# Altium schematic sheet [2] - Header and I2C.SchDoc: Header and I2C
size A4 portrait; ApprovedBy: Team 7; CheckedBy: Charitonidis A.; Author: Charitonidis Alexandros; DrawnBy: Charitonidis A.; Engineer: Charitonidis Alexandros; Organization: SMAQ; Address1: Glasgow; Address4: Australia 2086; DocumentNumber: SCH-001; Revision: 1.1; SheetNumber: 2; SheetTotal: 6
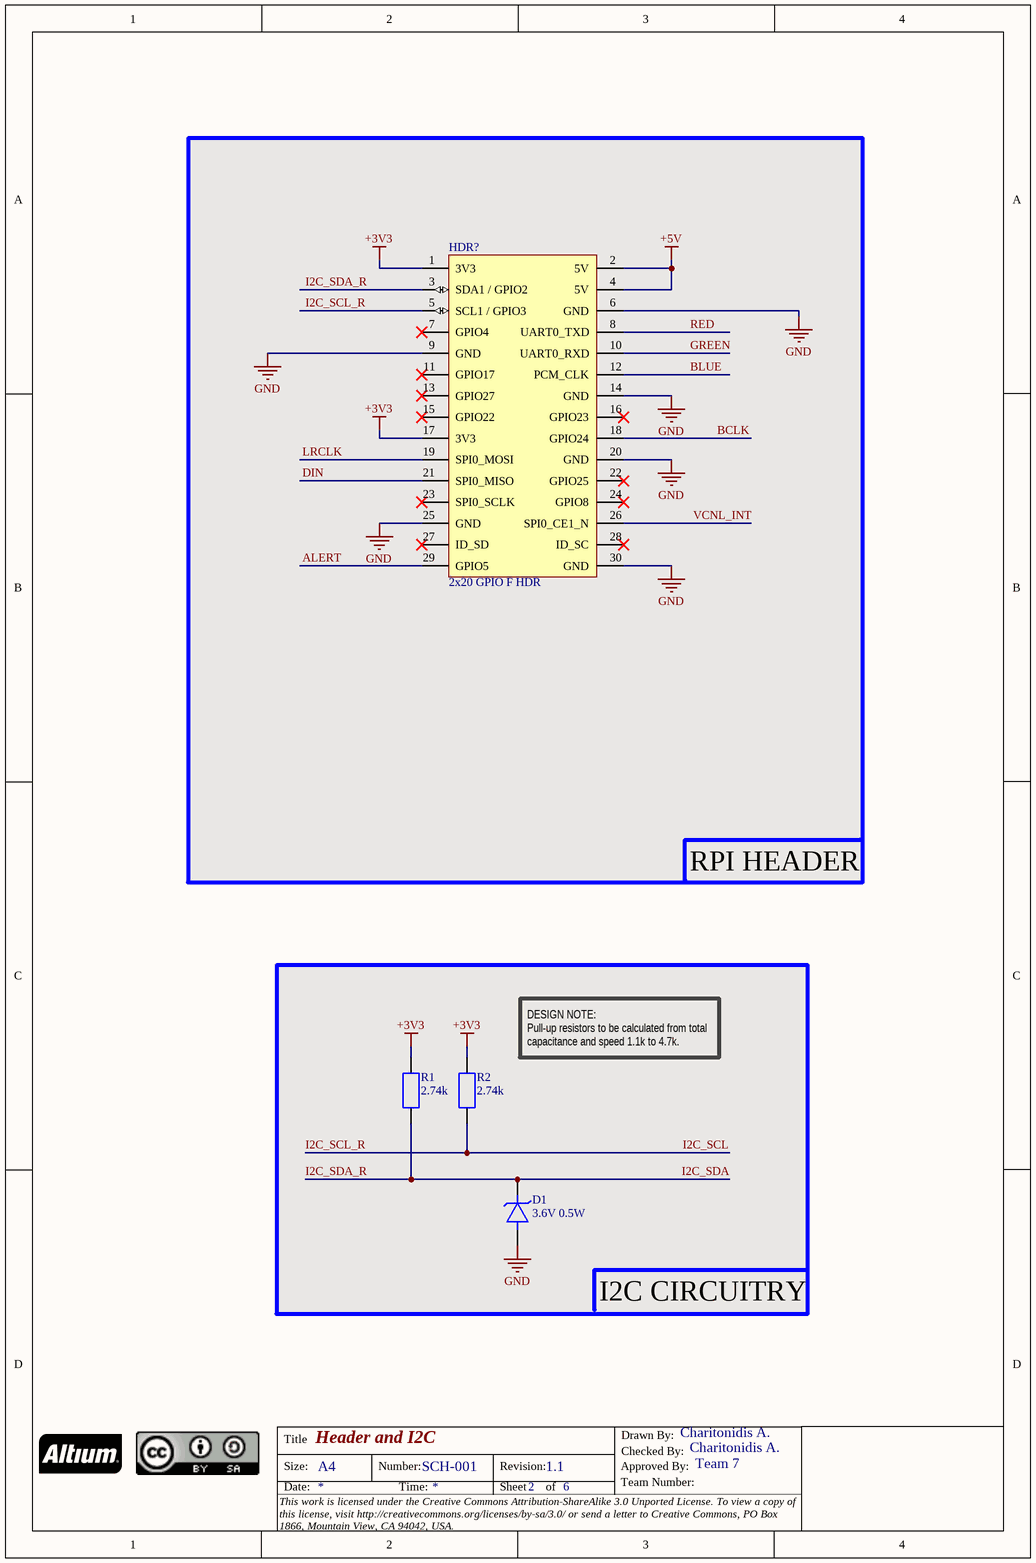
[diagram p0: [2] - Header and I2C.SchDoc]

## Parts
D1  3.6V 0.5W  [SOD-123]  (no BOM)
HDR?  2x20 GPIO F HDR  [2x20_Pi_Header]  (no BOM)
R1  2.74k  [R0805 (2012M)]  (no BOM)
R2  2.74k  [R0805 (2012M)]  (no BOM)

## Blocks framed on the sheet
RPI HEADER: HDR?
I2C CIRCUITRY: D1 R1 R2

## Nets
+3V3: HDR?.1(3V3) HDR?.17(3V3) R1.2 R2.2
+5V: HDR?.2(5V) HDR?.4(5V)
GND: D1.1 HDR?.6(GND) HDR?.9(GND) HDR?.14(GND) HDR?.20(GND) HDR?.25(GND) HDR?.30(GND)
ALERT: HDR?.29(GPIO5)
BCLK: HDR?.18(GPIO24)
BLUE: HDR?.12(PCM_CLK)
DIN: HDR?.21(SPI0_MISO)
GREEN: HDR?.10(UART0_RXD)
I2C_SCL: HDR?.5(SCL1_/_GPIO3) R2.1  [also labelled I2C_SCL_R]
I2C_SDA: D1.2 HDR?.3(SDA1_/_GPIO2) R1.1  [also labelled I2C_SDA_R]
LRCLK: HDR?.19(SPI0_MOSI)
RED: HDR?.8(UART0_TXD)
VCNL_INT: HDR?.26(SPI0_CE1_N)

Not connected (* = marked no-connect by the designer): HDR? 7(GPIO4)* 11(GPIO17)* 13(GPIO27)* 15(GPIO22)* 16(GPIO23)* 22(GPIO25)* 23(SPI0_SCLK)* 24(GPIO8)* 27(ID_SD)* 28(ID_SC)*

## Notes on the sheet
- DESIGN NOTE:
  Pull-up resistors to be calculated from total capacitance and speed 1.1k to 4.7k.
- Title
- Drawn By:
- Size:
- Date:
- A4
- Number:
- Time:
- Revision:
- Sheet
- of
- Approved By:
- Team Number:
- Checked By:
- This work is licensed under the Creative Commons Attribution-ShareAlike 3.0 Unported License. To view a copy of this license, visit http://creativecommons.org/licenses/by-sa/3.0/ or send a letter to Creative Commons, PO Box 1866, Mountain View, CA 94042, USA.

## Library data of the parts
D1 = BZT52B3V6-E3-08: Diode Zener Single 3.6V 2% 500mW 2-Pin SOD-123 T/R; Manufacturer 1: Vishay; Category 1: Zener Diodes; Max Power Dissipation: 410mW; Impedance: 80R; Zener Current: 100mA; Max Reverse Leakage Current: 100nA; Supplier 1: Mouser; Manufacturer Part Number 1: BZT52B3V6-E3-08; RoHS: Yes; Description 1: Diode Zener Single 3.6V 2% 500mW 2-Pin SOD-123 T/R; Stock 1: 29413; Mount: Surface Mount; Case/Package: SOD-123-2; Number of Pins: 2; Weight: 0.000363oz; Min Operating Temperature: -55°C; Max Operating Temperature: 150°C; Packaging: Tape and Reel; Package Quantity: 3000; Zener Voltage: 3.6V; Voltage Tolerance: 2%; Power Dissipation: 500mW; Element Configuration: Single; Tolerance: 2%; ComponentLink1URL: https://datasheet.ciiva.com/24095/bzt52-106265-24095710.pdf?src-supplier=Mouser; ComponentLink1Description: https://datasheet.ciiva.com/24095/bzt52-106265-24095710.pdf?src-supplier=Mouser; Supplier Part Number 1: 78-BZT52B3V6-E3-08
HDR? = 2X20 Female Header: GPIO FEMALE HEADER RASPBERRY PI; Manufacturer 1: Adafruit Industries; Manufacturer Part Number 1: 2222; Supplier 1: Mouser; RoHS: No; Description 1: GPIO FEMALE HEADER RASPBERRY PI; Stock 1: 1767; ComponentLink1URL: https://cdn-shop.adafruit.com/product-files/2222/00587.pdf?src-supplier=Digi-Key; ComponentLink1Description: https://cdn-shop.adafruit.com/product-files/2222/00587.pdf?src-supplier=Digi-Key; Supplier Part Number 1: 485-2222
R1 R2 = ERA-6AEB2741V: Surface Mount Chip Resistor, Thin Film, AEC-Q200 ERA Series, 2.74 kohm, 125 mW, 0.1%, 100 V; Manufacturer 1: Panasonic; Category 1: Chip SMD Resistors; Resistance: 2.74kR; Temperature Coefficient: 25ppm/°C; Power Rating: 125mW; Voltage Rating: 100V; Supplier 1: Farnell; Manufacturer Part Number 1: ERA-6AEB2741V; RoHS: Yes; Description 1: Surface Mount Chip Resistor, Thin Film, AEC-Q200 ERA Series, 2.74 kohm, 125 mW, 0.1%, 100 V; Stock 1: 20000; Pricing 1: 5000=0.02100 (GBP); Mount: Surface Mount; Case/Package: 0805; Number of Pins: 2; Contact Plating: Tin; Case Code (Imperial): 0805; Case Code (Metric): 2012; Min Operating Temperature: -55°C; Max Operating Temperature: 155°C; Tolerance: 0.1%; Composition: Metal Film,Thin Film; Packaging: Tape and Reel; Package Quantity: 1; Number of Terminations: 2; Military Standard: Not; Termination: Solder; Max Power Dissipation: 125mW; Voltage Rating (DC): 100V; Features: Automotive AEC-Q200; Length: 2mm; Height: 0.5mm; Width: 1.25mm; Depth: 1.25mm; Radiation Hardening: No; Lead Free: Lead Free; ComponentLink1URL: https://datasheet.ciiva.com/11812/0900766b80eb1d8c-11812023.pdf?src-supplier=RSComponents; ComponentLink1Description: https://datasheet.ciiva.com/11812/0900766b80eb1d8c-11812023.pdf?src-supplier=RSComponents; ComponentLink2URL: https://datasheet.ciiva.com/41450/001181270-da-01-en-widerstand-era-0805-2k74-0-1-5000st-41450431.pdf?src-supplier=Conrad; ComponentLink2Description: https://datasheet.ciiva.com/41450/001181270-da-01-en-widerstand-era-0805-2k74-0-1-5000st-41450431.pdf?src-supplier=Conrad; ComponentLink3URL: https://datasheet.ciiva.com/24025/aoa0000ce26-197354-24025606.pdf?src-supplier=Mouser; ComponentLink3Description: https://datasheet.ciiva.com/24025/aoa0000ce26-197354-24025606.pdf?src-supplier=Mouser; ComponentLink4URL: https://datasheet.ciiva.com/7763/485442-7763559.pdf?src-supplier=Element14; ComponentLink4Description: https://datasheet.ciiva.com/7763/485442-7763559.pdf?src-supplier=Element14; ComponentLink5URL: https://datasheet.ciiva.com/7763/485442-7763560.pdf?src-supplier=Element14; ComponentLink5Description: https://datasheet.ciiva.com/7763/485442-7763560.pdf?src-supplier=Element14; ComponentLink6URL: https://datasheet.ciiva.com/6129/485442-6129482.pdf?src-supplier=Farnell; ComponentLink6Description: https://datasheet.ciiva.com/6129/485442-6129482.pdf?src-supplier=Farnell; ComponentLink7URL: https://datasheet.ciiva.com/6129/485442-6129483.pdf?src-supplier=Farnell; ComponentLink7Description: https://datasheet.ciiva.com/6129/485442-6129483.pdf?src-supplier=Farnell; ComponentLink8URL: https://datasheet.ciiva.com/6129/485442-6129478.pdf?src-supplier=Farnell; ComponentLink8Description: https://datasheet.ciiva.com/6129/485442-6129478.pdf?src-supplier=Farnell; ComponentLink9URL: https://datasheet.ciiva.com/9196/aoa0000ce26-9196845.pdf?src-supplier=Avnet; ComponentLink9Description: https://datasheet.ciiva.com/9196/aoa0000ce26-9196845.pdf?src-supplier=Avnet; Supplier Part Number 1: 1810978